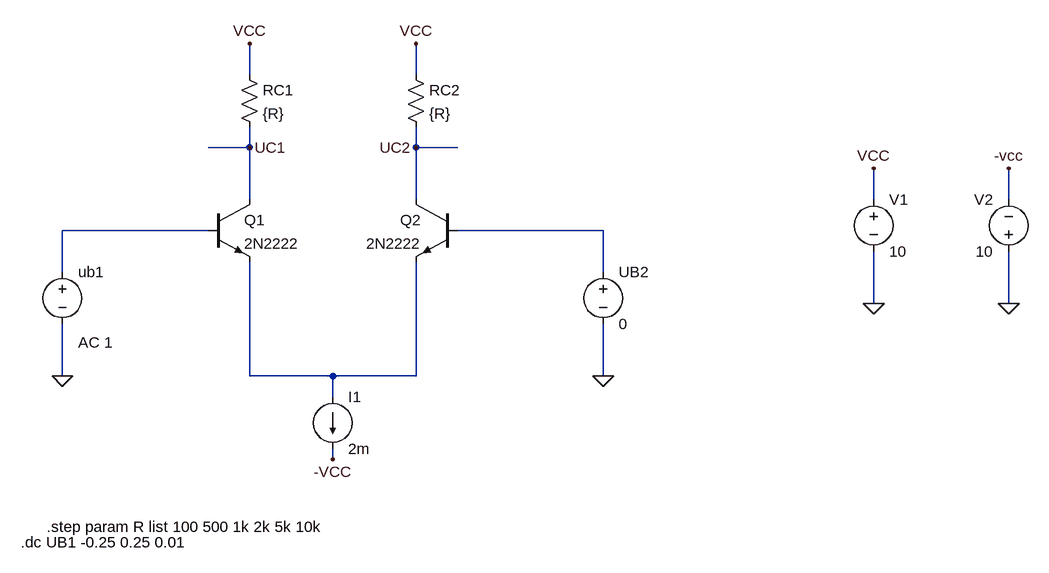
[diagram p0: schematic meros 4o A).asc]
meros 4o A).asc, the LTspice schematic file:
Version 4
SHEET 1 948 680
WIRE -256 -320 -256 -368
WIRE 0 -320 0 -368
WIRE -256 -208 -256 -240
WIRE -256 -208 -320 -208
WIRE 0 -208 0 -240
WIRE 64 -208 0 -208
WIRE -256 -128 -256 -208
WIRE 0 -128 0 -208
WIRE 704 -128 704 -176
WIRE 912 -128 912 -176
WIRE -320 -80 -544 -80
WIRE 288 -80 64 -80
WIRE -544 -16 -544 -80
WIRE 288 -16 288 -80
WIRE 704 32 704 -48
WIRE 912 32 912 -48
WIRE -544 144 -544 64
WIRE -256 144 -256 -32
WIRE -128 144 -256 144
WIRE 0 144 0 -32
WIRE 0 144 -128 144
WIRE 288 144 288 64
WIRE -128 176 -128 144
WIRE -128 272 -128 256
FLAG 704 32 0
FLAG 704 -176 VCC
FLAG 0 -368 VCC
FLAG -256 -368 VCC
FLAG -256 -208 UC1
FLAG 0 -208 UC2
FLAG -128 272 -VCC
FLAG 912 -176 -vcc
FLAG 912 32 0
FLAG 288 144 0
FLAG -544 144 0
SYMBOL npn -320 -128 R0
SYMATTR InstName Q1
SYMATTR Value 2N2222
SYMBOL npn 64 -128 M0
SYMATTR InstName Q2
SYMATTR Value 2N2222
SYMBOL res -16 -336 R0
SYMATTR InstName RC2
SYMATTR Value {R}
SYMBOL res -272 -336 R0
SYMATTR InstName RC1
SYMATTR Value {R}
SYMBOL voltage 288 -32 R0
SYMATTR InstName UB2
SYMATTR Value 0
SYMBOL voltage 704 -144 R0
SYMATTR InstName V1
SYMATTR Value 10
SYMBOL current -128 176 R0
SYMATTR InstName I1
SYMATTR Value 2m
SYMBOL voltage -544 -32 R0
WINDOW 123 24 124 Left 2
WINDOW 39 0 0 Left 0
WINDOW 3 24 44 Left 2
SYMATTR Value2 AC 1
SYMATTR Value ""
SYMATTR InstName ub1
SYMBOL voltage 912 -32 R180
WINDOW 0 24 96 Left 2
WINDOW 3 24 16 Left 2
SYMATTR InstName V2
SYMATTR Value 10
TEXT -568 376 Left 2 !.step param R list 100 500 1k 2k 5k 10k
TEXT -608 400 Left 2 !.dc UB1 -0.25 0.25 0.01

The netlist it stands for:
* meros 4o A).asc
Q1 UC1 N001 N003 0 2N2222
Q2 UC2 N002 N003 0 2N2222
RC2 VCC UC2 {R}
RC1 VCC UC1 {R}
V§UB2 N002 0 0
V1 VCC 0 10
I1 N003 -VCC 2m
V§ub1 N001 0 AC 1
V2 0 -VCC 10
.model NPN NPN
.model PNP PNP
.lib standard.bjt
.step param R list 100 500 1k 2k 5k 10k
.dc UB1 -0.25 0.25 0.01
.backanno
.end